# Altium schematic sheet Part K.SchDoc
size A4; SheetNumber: 6; SheetTotal: 16
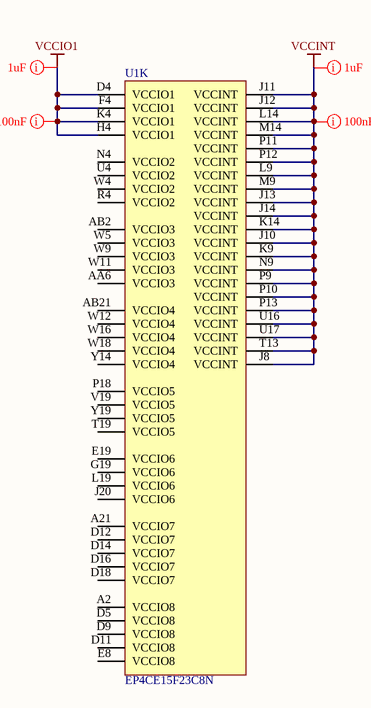
[diagram p0: Part K.SchDoc]

## Parts
U1  EP4CE15F23C8N  [FBGA484_A-240]  (part K of 13)

## Nets
VCCINT: U1.J8(VCCINT) U1.J10(VCCINT) U1.J11(VCCINT) U1.J12(VCCINT) U1.J13(VCCINT) U1.J14(VCCINT) U1.K9(VCCINT) U1.K14(VCCINT) U1.L9(VCCINT) U1.L14(VCCINT) U1.M9(VCCINT) U1.M14(VCCINT) U1.N9(VCCINT) U1.P9(VCCINT) U1.P10(VCCINT) U1.P11(VCCINT) U1.P12(VCCINT) U1.P13(VCCINT) U1.T13(VCCINT) U1.U16(VCCINT) U1.U17(VCCINT)
VCCIO1: U1.D4(VCCIO1) U1.F4(VCCIO1) U1.H4(VCCIO1) U1.K4(VCCIO1)

Not connected (* = marked no-connect by the designer): U1 A2(VCCIO8) A21(VCCIO7) AA6(VCCIO3) AB2(VCCIO3) AB21(VCCIO4) D5(VCCIO8) D9(VCCIO8) D11(VCCIO8) D12(VCCIO7) D14(VCCIO7) D16(VCCIO7) D18(VCCIO7) E8(VCCIO8) E19(VCCIO6) G19(VCCIO6) J20(VCCIO6) L19(VCCIO6) N4(VCCIO2) P18(VCCIO5) R4(VCCIO2) T19(VCCIO5) U4(VCCIO2) V19(VCCIO5) W4(VCCIO2) W5(VCCIO3) W9(VCCIO3) W11(VCCIO3) W12(VCCIO4) W16(VCCIO4) W18(VCCIO4) Y14(VCCIO4) Y19(VCCIO5)

## Layout directives
mark named 1uF: VCCINT, VCCIO1
mark named 100nF: VCCINT, VCCIO1

## Library data of the parts
U1 = FPGA_EP4CE15F23C8N: Cyclone IV Family FPGA, 1.2V Core, 343 I/O Pins, 4 PLLs, 484-Pin FBGA, Speed Grade 8, Commercial Grade, Pb-Free; Manufacturer: Altera; PackageVersion: ver1.0, Jun-2011; PackageReference: FBGA484_A-240; ComponentLink3URL: http://www.altera.com/literature/lit-dp.jsp?category=cyc%204&showspreadsheet=y; ComponentLink1Description: Manufacturer URL; DatasheetVersion: ver1.6, Nov-2011; ComponentLink3Description: Pinout; ComponentLink2URL: http://www.altera.com/literature/hb/cyclone-iv/cyclone4-handbook.pdf; ComponentLink1URL: http://www.altera.com/; ComponentLink2Description: Handbook; PackageDescription: 484-Pin FineLine Ball Grid Array (FBGA) - Wire Bond - A:2.40; Code_JEDEC: MS-034-AAJ-1; ComponentLink4URL: http://www.altera.com/devicepackaging/04R00247-02.pdf; ComponentLink4Description: Package Specification